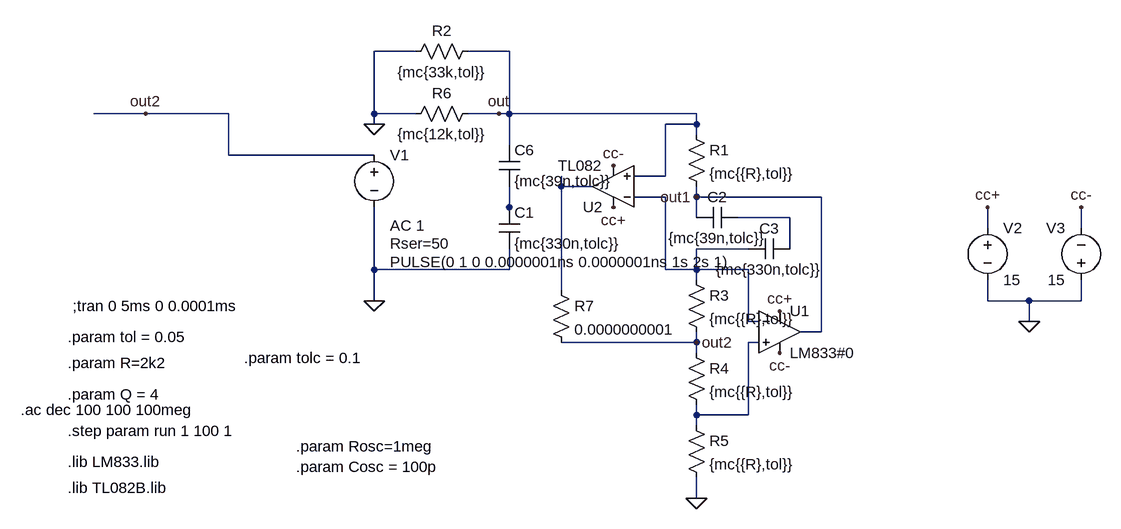
[diagram p0: schematic tc_tp3_ej1 TL082 zout.asc]
tc_tp3_ej1 TL082 zout.asc, the LTspice schematic file:
Version 4
SHEET 1 1140 680
WIRE -16 -80 -80 -80
WIRE 128 -80 64 -80
WIRE -432 16 -512 16
WIRE -304 16 -432 16
WIRE -80 16 -80 -80
WIRE -16 16 -80 16
WIRE 112 16 64 16
WIRE 128 16 128 -80
WIRE 128 16 112 16
WIRE 416 16 128 16
WIRE -80 32 -80 16
WIRE 416 32 416 16
WIRE 416 32 368 32
WIRE 416 48 416 32
WIRE 128 64 128 16
WIRE -304 80 -304 16
WIRE -80 80 -304 80
WIRE 368 112 368 32
WIRE 368 112 320 112
WIRE 208 128 208 112
WIRE 256 128 208 128
WIRE 368 144 320 144
WIRE 416 144 416 128
WIRE 608 144 416 144
WIRE 128 160 128 128
WIRE 128 176 128 160
WIRE 416 176 416 144
WIRE 560 176 480 176
WIRE 864 192 864 160
WIRE 1008 192 1008 160
WIRE 496 224 416 224
WIRE 560 224 560 176
WIRE -80 256 -80 160
WIRE 128 256 128 224
WIRE 128 256 -80 256
WIRE 368 256 368 144
WIRE 416 256 416 224
WIRE 416 256 368 256
WIRE 496 256 416 256
WIRE 416 272 416 256
WIRE 208 288 208 128
WIRE -80 304 -80 256
WIRE 864 304 864 272
WIRE 928 304 864 304
WIRE 1008 304 1008 272
WIRE 1008 304 928 304
WIRE 496 336 496 256
WIRE 512 336 496 336
WIRE 928 336 928 304
WIRE 608 352 608 144
WIRE 608 352 576 352
WIRE 416 368 416 352
WIRE 416 368 208 368
WIRE 512 368 496 368
WIRE 416 384 416 368
WIRE 416 480 416 464
WIRE 496 480 496 368
WIRE 496 480 416 480
WIRE 416 496 416 480
WIRE 416 608 416 576
FLAG 416 608 0
FLAG 416 144 out1
FLAG 416 368 out2
FLAG 928 336 0
FLAG 864 160 cc+
FLAG 544 384 cc-
FLAG 288 160 cc+
FLAG 1008 160 cc-
FLAG 544 320 cc+
FLAG 288 96 cc-
FLAG 112 16 out
FLAG -80 304 0
FLAG -80 32 0
FLAG -432 16 out2
SYMBOL voltage -80 64 R0
WINDOW 123 24 124 Left 2
WINDOW 39 24 152 Left 2
WINDOW 3 24 180 Left 2
SYMATTR Value2 AC 1
SYMATTR SpiceLine Rser=50
SYMATTR Value PULSE(0 1 0 0.0000001ns 0.0000001ns 1s 2s 1)
SYMATTR InstName V1
SYMBOL res 80 0 R90
WINDOW 0 0 56 VBottom 2
WINDOW 3 32 56 VTop 2
SYMATTR InstName R6
SYMATTR Value {mc{12k,tol}}
SYMBOL cap 112 64 R0
SYMATTR InstName C6
SYMATTR Value {mc{39n,tolc}}
SYMBOL res 400 32 R0
SYMATTR InstName R1
SYMATTR Value {mc{{R},tol}}
SYMBOL res 400 256 R0
SYMATTR InstName R3
SYMATTR Value {mc{{R},tol}}
SYMBOL res 400 368 R0
SYMATTR InstName R4
SYMATTR Value {mc{{R},tol}}
SYMBOL res 400 480 R0
SYMATTR InstName R5
SYMATTR Value {mc{{R},tol}}
SYMBOL Opamps\\opamp2 544 288 R0
SYMATTR InstName U1
SYMATTR Value LM833#0
SYMBOL Opamps\\opamp2 288 192 R180
SYMATTR InstName U2
SYMATTR Value TL082
SYMBOL voltage 864 176 R0
WINDOW 123 0 0 Left 0
WINDOW 39 0 0 Left 0
SYMATTR InstName V2
SYMATTR Value 15
SYMBOL voltage 1008 288 R180
WINDOW 0 24 96 Left 2
WINDOW 3 24 16 Left 2
WINDOW 123 0 0 Left 0
WINDOW 39 0 0 Left 0
SYMATTR InstName V3
SYMATTR Value 15
SYMBOL res 80 -96 R90
WINDOW 0 0 56 VBottom 2
WINDOW 3 32 56 VTop 2
SYMATTR InstName R2
SYMATTR Value {mc{33k,tol}}
SYMBOL cap 112 160 R0
SYMATTR InstName C1
SYMATTR Value {mc{330n,tolc}}
SYMBOL cap 480 160 R90
WINDOW 0 0 32 VBottom 2
WINDOW 3 32 32 VTop 2
SYMATTR InstName C2
SYMATTR Value {mc{39n,tolc}}
SYMBOL cap 560 208 R90
WINDOW 0 0 32 VBottom 2
WINDOW 3 32 32 VTop 2
SYMATTR InstName C3
SYMATTR Value {mc{330n,tolc}}
SYMBOL res 192 272 R0
SYMATTR InstName R7
SYMATTR Value 0.0000000001
TEXT -552 400 Left 2 !.param R=2k2
TEXT -552 448 Left 2 !.param Q = 4
TEXT -624 472 Left 2 !.ac dec 100 100 100meg
TEXT -552 552 Left 2 !.lib LM833.lib
TEXT -552 360 Left 2 !.param tol = 0.05
TEXT -552 504 Left 2 !.step param run 1 100 1
TEXT -544 312 Left 2 !;tran 0 5ms 0 0.0001ms
TEXT -552 592 Left 2 !.lib TL082B.lib
TEXT -200 528 Left 2 !.param Rosc=1meg
TEXT -200 560 Left 2 !.param Cosc = 100p
TEXT -280 392 Left 2 !.param tolc = 0.1

The netlist it stands for:
* tc_tp3_ej1 TL082 zout.asc
V1 out2 0 PULSE(0 1 0 0.0000001ns 0.0000001ns 1s 2s 1) AC 1 Rser=50
R6 out 0 {mc{12k,tol}}
C6 out N003 {mc{39n,tolc}}
R1 out out1 {mc{{R},tol}}
R3 N002 out2 {mc{{R},tol}}
R4 out2 N005 {mc{{R},tol}}
R5 N005 0 {mc{{R},tol}}
XU1 N005 N002 cc+ cc- out1 LM833#0  ; pins In+ In- V+ V- OUT
XU2 out N002 cc+ cc- N001 TL082  ; pins In+ In- V+ V- OUT
V2 cc+ 0 15
V3 0 cc- 15
R2 out 0 {mc{33k,tol}}
C1 N003 0 {mc{330n,tolc}}
C2 N004 out1 {mc{39n,tolc}}
C3 N004 N002 {mc{330n,tolc}}
R7 N001 out2 0.0000000001
.param R=2k2
.param Q = 4
.ac dec 100 100 100meg
.lib LM833.lib
.param tol = 0.05
.step param run 1 100 1
;tran 0 5ms 0 0.0001ms
.lib TL082B.lib
.param Rosc=1meg
.param Cosc = 100p
.param tolc = 0.1
.backanno
.end